# EAGLE design daksh_only (EAGLE 9.3.0)
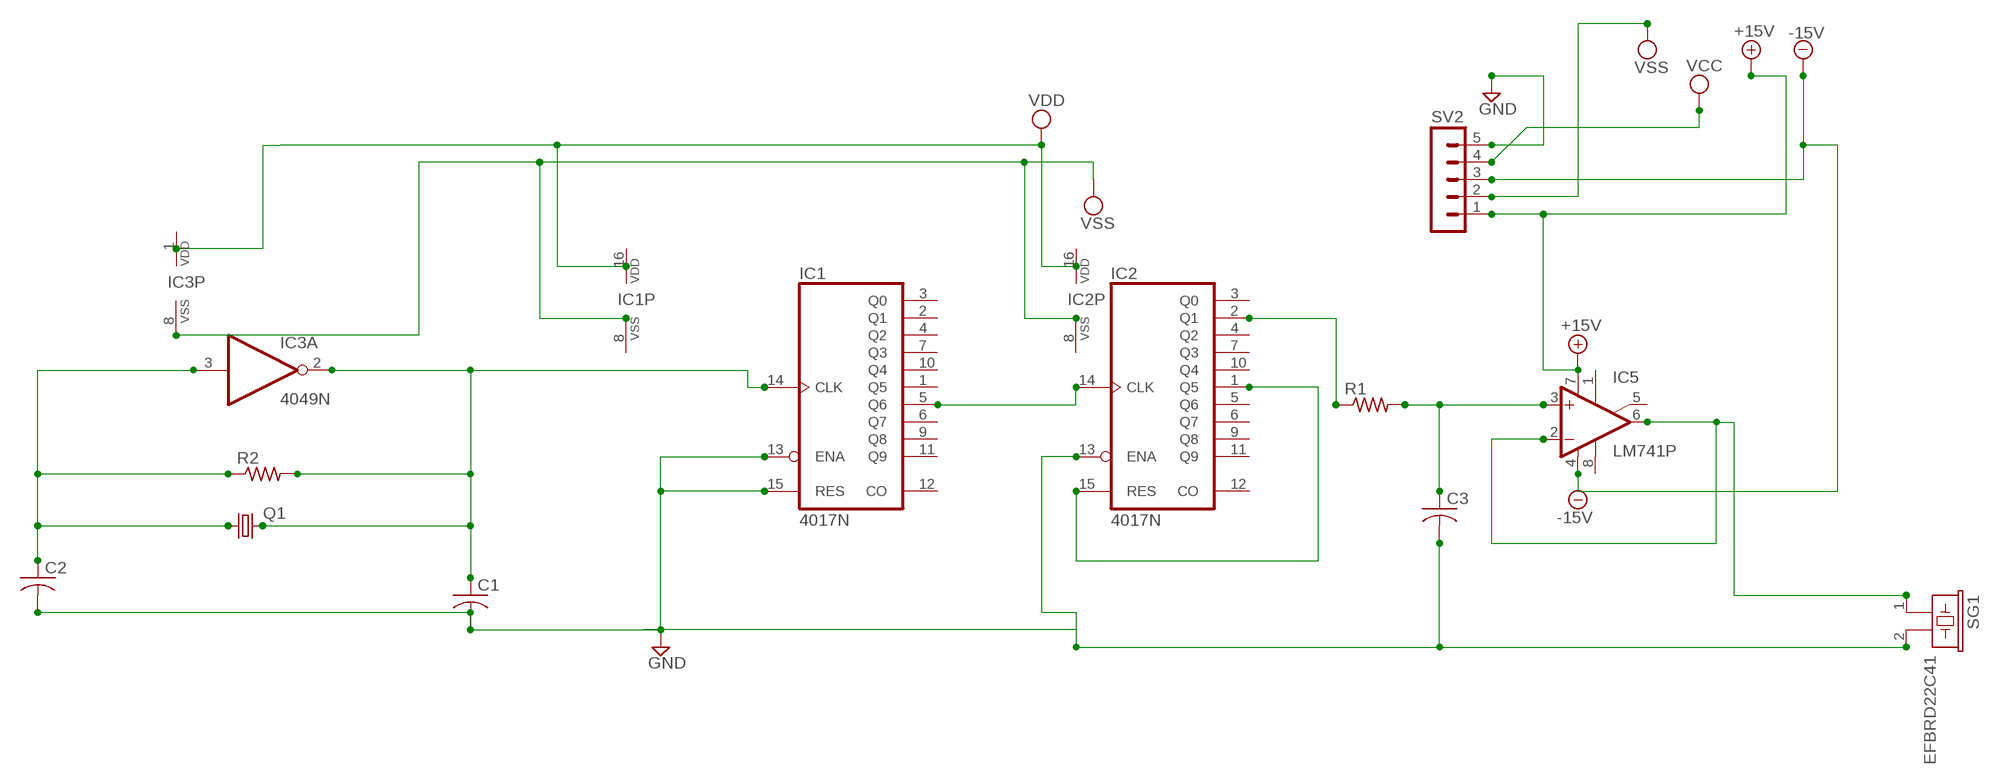
[diagram p0: schematic, sheet 1]

## Parts
C1  C-US025-024X044  [C025-024X044]
C2  C-US025-024X044  [C025-024X044]
C3  C-US025-024X044  [C025-024X044]
IC1  4017N  [DIL16]
IC2  4017N  [DIL16]
IC3  4049N  [DIL16]
IC5  LM741P  [DIL08]
Q1  CRYSTALHC49U-H  [HC49U-H]
R1  R-US_0204/5  [0204/5]
R2  R-US_0204/5  [0204/5]
SG1  EFBRD22C41  [EFBRD22C41]
SV2  MA05-1  [MA05-1]

## Nets
+15V: IC5.7(V+) SV2.1
-15V: IC5.4(V-) SV2.3
GND: C1.2 C2.2 C3.2 IC1.13(ENA) IC1.15(RES) IC2.13(ENA) SG1.2 SV2.5
N$1: C2.1 IC3.3(A:I) Q1.1 R2.1
N$2: C1.1 IC1.14(CLK) IC3.2(A:O) Q1.2 R2.2
N$3: IC1.5(Q6) IC2.14(CLK)
N$4: IC2.2(Q1) R1.1
N$5: IC2.1(Q5) IC2.15(RES)
N$6: C3.1 IC5.3(+IN) R1.2
N$9: IC5.2(-IN) IC5.6(OUT) SG1.1
VCC: SV2.4
VSS: IC3.8(P:VSS) SV2.2
Unconnected: IC1.1(Q5) IC1.2(Q1) IC1.3(Q0) IC1.4(Q2) IC1.6(Q7) IC1.7(Q3) IC1.9(Q8) IC1.10(Q4) IC1.11(Q9) IC1.12(CO) IC2.3(Q0) IC2.4(Q2) IC2.5(Q6) IC2.6(Q7) IC2.7(Q3) IC2.9(Q8) IC2.10(Q4) IC2.11(Q9) IC2.12(CO) IC3.4(B:O) IC3.5(B:I) IC3.6(C:O) IC3.7(C:I) IC3.9(D:I) IC3.10(D:O) IC3.11(E:I) IC3.12(E:O) IC3.14(F:I) IC3.15(F:O) IC5.1(ON1) IC5.5(ON2) IC5.8(OPT)

## Power pins joined to a net without a drawn wire
VDD: IC1.16(VDD) IC2.16(VDD) IC3.1(P:VDD)
VSS: IC1.8(VSS) IC2.8(VSS)

## Library data of the parts
C1-C3 = rcl:C-US: CAPACITOR, American symbol; SPICEPREFIX: C
IC1 IC2 = 40xx:4017: COUNTER/DIVIDER
IC3 = 40xx:4049: Hex inverting BUFFER
IC5 = linear:*741: OP AMP
Q1 = crystal:CRYSTAL: CRYSTAL; OC_FARNELL: 1666973; OC_NEWARK: unknown
R1 R2 = rcl:R-US_: RESISTOR, American symbol; SPICEPREFIX: R
SG1 = buzzer:EFB?: Piezoelectric Acoustic Transducer Source: Panbasonic .. 2SC1685.pdf; OC_FARNELL: unknown; OC_NEWARK: unknown
SV2 = con-lstb:MA05-1: PIN HEADER; OC_FARNELL: unknown; OC_NEWARK: unknown

## Board
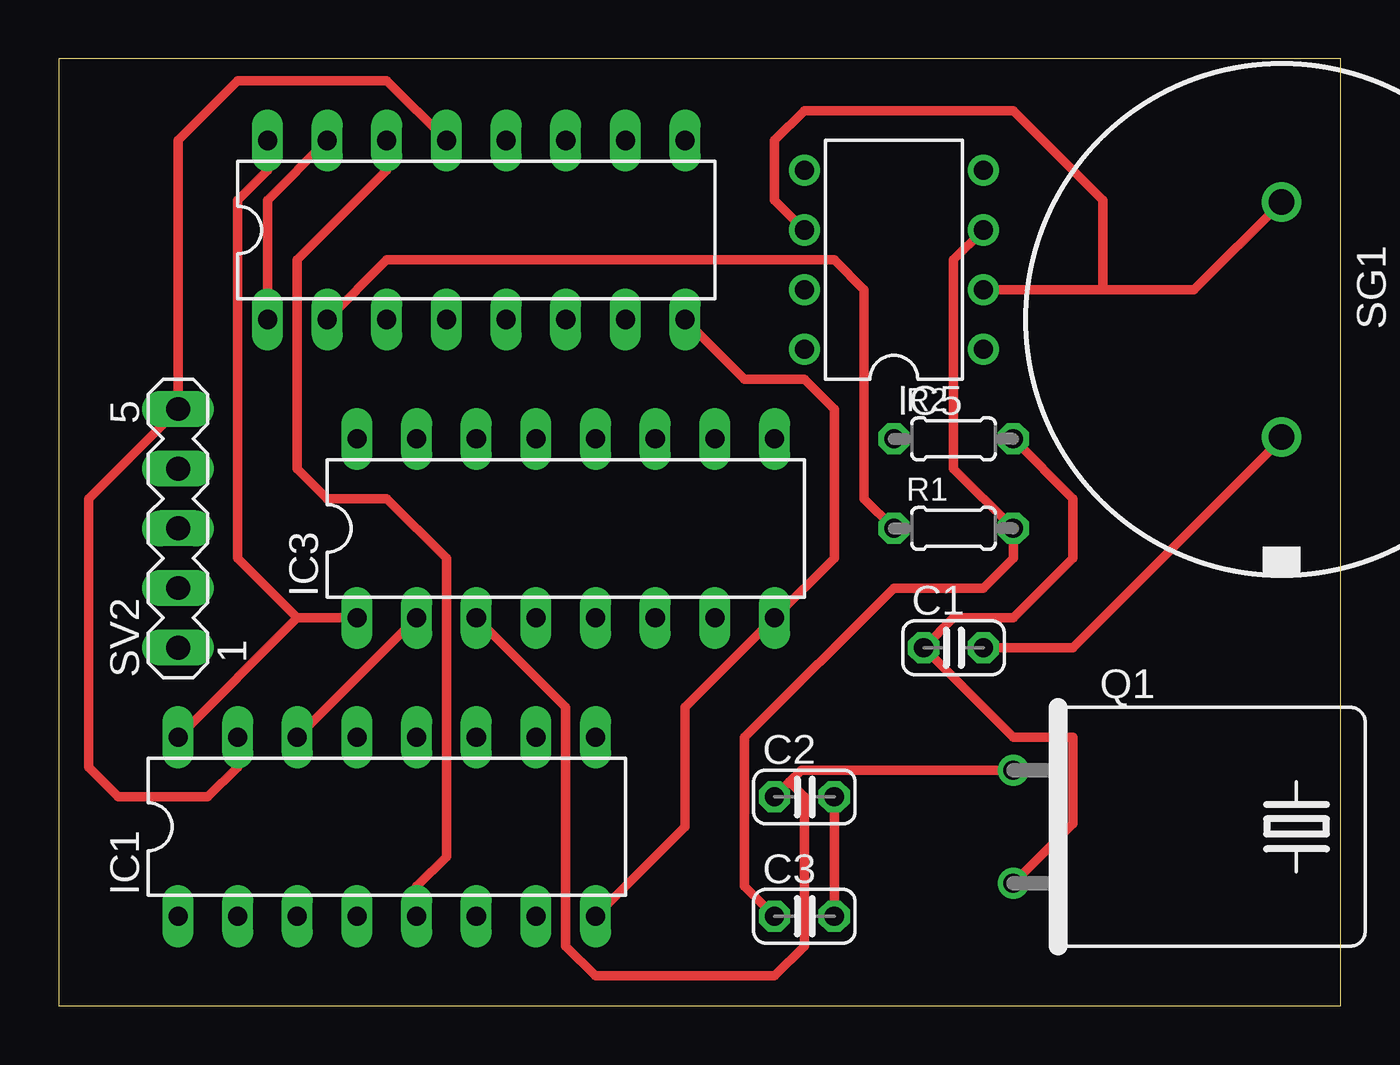
[diagram p1: board, top side]
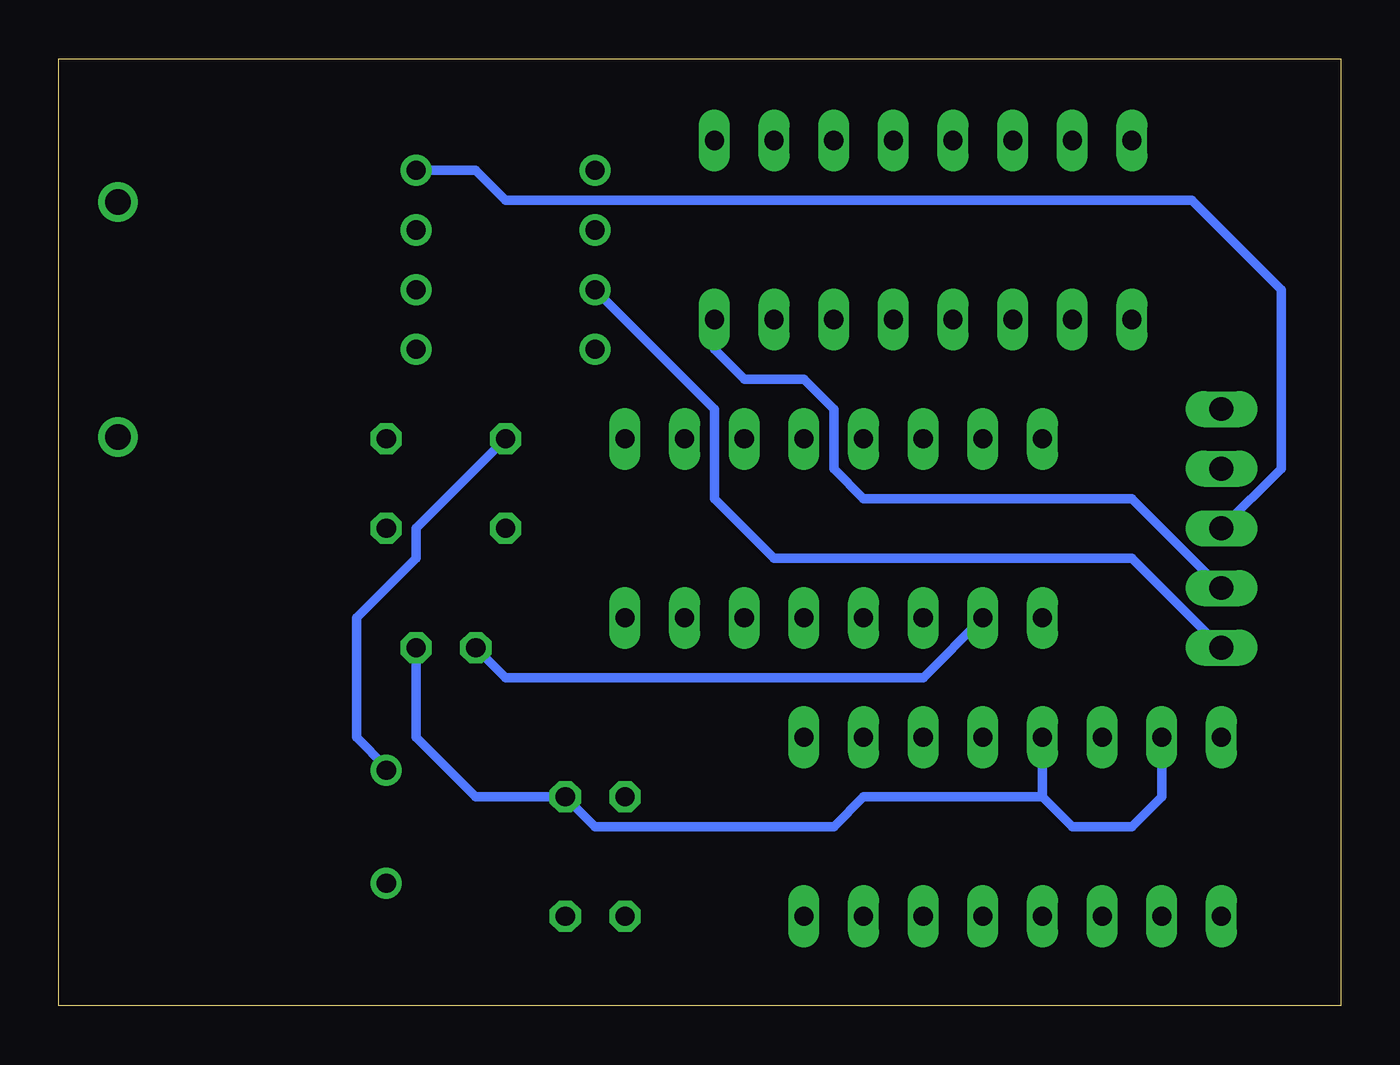
[diagram p2: board, bottom side, seen from below]

Size 54.59 x 40.31 mm. Coordinates in mm from the lower left corner, seen from the top.
Outline: 0,0 54.59,0 54.59,40.31 0,40.31 0,0
Copper layers (1*16): Top 0.035mm / dielectric 1.5mm / Bottom 0.035mm
Design rules "default *": minimum track width 16mil, minimum drill 0.35mm, track to track 10mil, track to pad 10mil, pad to pad 10mil, via to via 10mil, smd to smd 10mil, copper to edge 0.6mm, drill to drill 13mil, minimum pad ring 10mil, minimum via ring 8mil, stop-mask expansion 4mil, vias tented up to drill 0mil, thermal gap 10mil

### Footprints (pad centres in the part's own frame; a part is rotated, then mirrored left to right if it is on the bottom)
C025-024X044 = drill 0.813 octagon: 1 -1.27,0; 2 1.27,0
DIL16 = drill 0.813 long: 1 -8.89,-3.81; 2 -6.35,-3.81; 3 -3.81,-3.81; 4 -1.27,-3.81; 5 1.27,-3.81; 6 3.81,-3.81; 7 6.35,-3.81; 8 8.89,-3.81; 9 8.89,3.81; 10 6.35,3.81; 11 3.81,3.81; 12 1.27,3.81; 13 -1.27,3.81; 14 -3.81,3.81; 15 -6.35,3.81; 16 -8.89,3.81
DIL08 = drill 0.813 pad 1.27: 1 -3.81,-3.81; 2 -1.27,-3.81; 3 1.27,-3.81; 4 3.81,-3.81; 5 3.81,3.81; 6 1.27,3.81; 7 -1.27,3.81; 8 -3.81,3.81
HC49U-H = drill 0.813: 1 -2.413,-5.08; 2 2.413,-5.08
0204/5 = drill 0.813 octagon: 1 -2.54,0; 2 2.54,0
EFBRD22C41 = drill 1.1 pad 1.676: 1 -5,0; 2 5,0
MA05-1 = drill 1.016 long: 1 -5.08,0; 2 -2.54,0; 3 0,0; 4 2.54,0; 5 5.08,0

### Placement (x,y rotation side)
C1  38.1,15.24 0 top
C2  31.75,8.89 0 top
C3  31.75,3.81 0 top
IC1  13.97,7.62 0 top
IC2  17.78,33.02 0 top
IC3  21.59,20.32 0 top
IC5  35.56,31.75 90 top
Q1  45.72,7.62 270 top
R1  38.1,20.32 0 top
R2  38.1,24.13 0 top
SG1  52.07,29.21 270 top
SV2  5.08,20.32 90 top

### Tracks (layer width: path | path; a pad name or v marks a point on that pad's centre or on a via)
+15V
  Bottom 0.406: IC5.7 26.67,25.4 26.67,21.59 24.13,19.05 8.89,19.05 SV2.1
-15V
  Bottom 0.406: SV2.3 2.54,22.86 2.54,30.48 6.35,34.29 35.56,34.29 36.83,35.56 IC5.4
GND
  Top 0.406: C3.2 C2.2 | C1.2 43.18,15.24 52.07,24.13 SG1.2 | IC1.15 7.62,10.16 6.35,8.89 2.54,8.89 1.27,10.16 1.27,21.59 SV2.5 5.08,36.83 7.62,39.37 13.97,39.37 IC2.13
  Bottom 0.406: IC1.15 7.62,8.89 8.89,7.62 11.43,7.62 12.7,8.89 | 12.7,8.89 IC1.13 | 12.7,8.89 20.32,8.89 21.59,7.62 31.75,7.62 C2.2 36.83,8.89 39.37,11.43 C1.2
N$1
  Top 0.406: Q1.1 31.62,10.03 31.11,9.53 | 31.11,9.53 C2.1 | 31.11,9.53 31.75,8.89 31.75,2.54 30.48,1.27 22.86,1.27 21.59,2.54 21.59,12.7 IC3.3
  Bottom 0.406: R2.1 39.37,20.32 39.37,19.05 41.91,16.51 41.91,11.43 40.64,10.16 Q1.1
N$2
  Top 0.406: Q1.2 43.18,7.75 43.18,11.43 40.64,11.43 C1.1 38.1,16.51 40.64,16.51 43.18,19.05 43.18,21.59 R2.2 | IC1.14 IC3.2
  Bottom 0.406: IC3.2 17.78,13.97 35.56,13.97 C1.1
N$3
  Top 0.406: IC2.14 13.97,35.56 10.16,31.75 10.16,22.86 11.43,21.59 13.97,21.59 16.51,19.05 16.51,6.35 15.24,5.08 IC1.5
N$4
  Top 0.406: IC2.2 13.97,31.75 33.02,31.75 34.29,30.48 34.29,21.59 R1.1
N$5
  Top 0.406: IC2.15 8.89,34.29 IC2.1
N$6
  Top 0.406: C3.1 29.21,5.08 29.21,11.43 35.56,17.78 39.37,17.78 40.64,19.05 R1.2 38.1,22.86 38.1,31.75 IC5.3
N$9
  Top 0.406: SG1.1 48.34,30.48 44.45,30.48 | 44.45,30.48 IC5.2 | IC5.6 30.48,34.29 30.48,36.83 31.75,38.1 40.64,38.1 44.45,34.29 44.45,30.48
VDD
  Top 0.406: IC1.16 10.16,16.51 | 10.16,16.51 IC3.1 | IC2.16 8.89,35.56 7.62,34.29 7.62,19.05 10.16,16.51
VSS
  Top 0.406: IC1.8 26.67,7.62 26.67,12.7 IC3.8 33.02,19.05 33.02,25.4 31.75,26.67 29.21,26.67 IC2.8
  Bottom 0.406: SV2.2 8.89,21.59 20.32,21.59 21.59,22.86 21.59,25.4 22.86,26.67 25.4,26.67 26.67,27.94 IC2.8